# EAGLE design untitled (EAGLE 9.6.2)
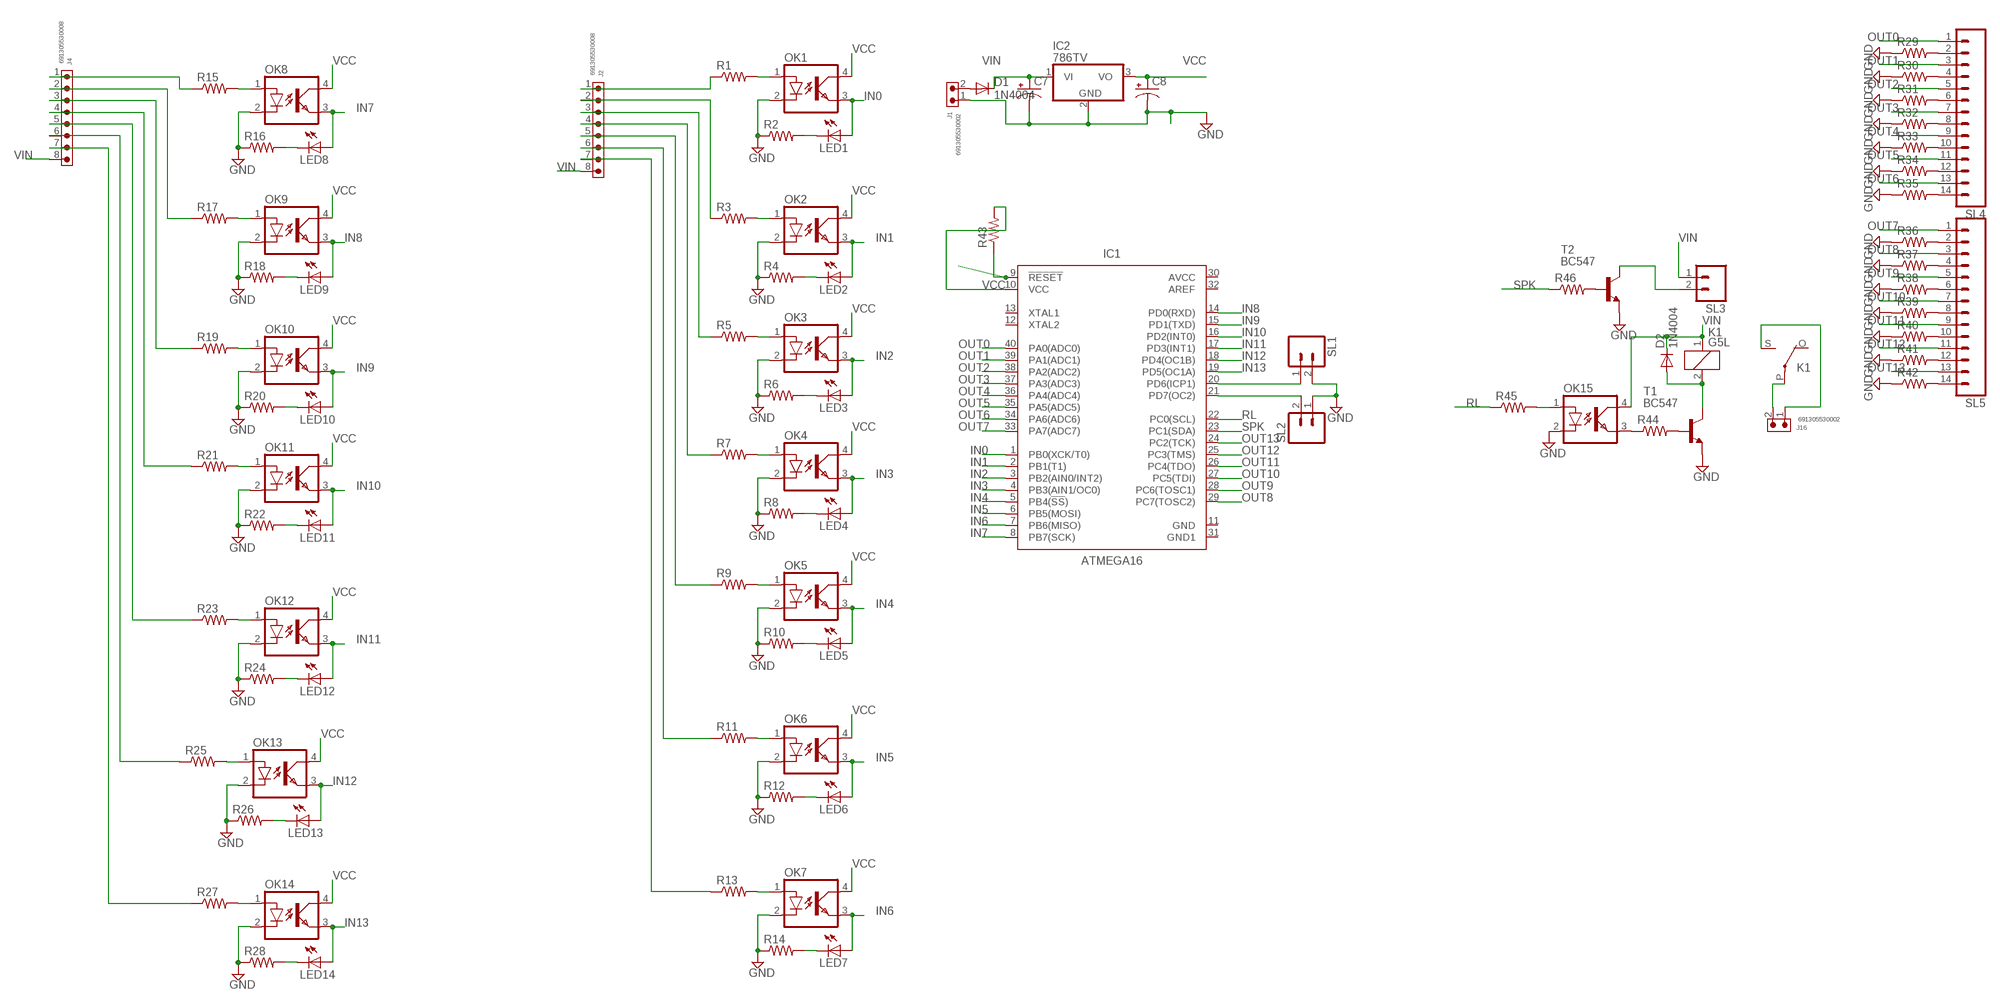
[diagram p0: schematic, sheet 1]

## Parts
C7  CAPACITOR-PE5-10.5  [E5-10,5]
C8  CAPACITOR-PE5-6  [E5-6]
D1  1N4004  [DO41-10]
D2  1N4004  [DO41-10]
IC1  ATMEGA16  ATMEGA32-16PU_DIP  [DIP1587W56P254L5229H482Q40B]
IC2  786TV  [TO220V]
J1  691305530002  691305530002  [691305530002]
J2  691305530008  691305530008  [691305530008]
J4  691305530008  691305530008  [691305530008]
J16  691305530002  691305530002  [691305530002]
K1  G5L  [G5LE]
LED1  LED3MM  [LED3MM]
LED2  LED3MM  [LED3MM]
LED3  LED3MM  [LED3MM]
LED4  LED3MM  [LED3MM]
LED5  LED3MM  [LED3MM]
LED6  LED3MM  [LED3MM]
LED7  LED3MM  [LED3MM]
LED8  LED3MM  [LED3MM]
LED9  LED3MM  [LED3MM]
LED10  LED3MM  [LED3MM]
LED11  LED3MM  [LED3MM]
LED12  LED3MM  [LED3MM]
LED13  LED3MM  [LED3MM]
LED14  LED3MM  [LED3MM]
OK1  PC817  [DIL04]
OK2  PC817  [DIL04]
OK3  PC817  [DIL04]
OK4  PC817  [DIL04]
OK5  PC817  [DIL04]
OK6  PC817  [DIL04]
OK7  PC817  [DIL04]
OK8  PC817  [DIL04]
OK9  PC817  [DIL04]
OK10  PC817  [DIL04]
OK11  PC817  [DIL04]
OK12  PC817  [DIL04]
OK13  PC817  [DIL04]
OK14  PC817  [DIL04]
OK15  PC817  [DIL04]
R1  R-US_0204/2V  [0204V]
R2  R-US_0207/7  [0207/7]
R3  R-US_0204/2V  [0204V]
R4  R-US_0207/7  [0207/7]
R5  R-US_0204/2V  [0204V]
R6  R-US_0207/7  [0207/7]
R7  R-US_0204/2V  [0204V]
R8  R-US_0207/7  [0207/7]
R9  R-US_0204/2V  [0204V]
R10  R-US_0207/7  [0207/7]
R11  R-US_0204/2V  [0204V]
R12  R-US_0207/7  [0207/7]
R13  R-US_0204/2V  [0204V]
R14  R-US_0207/7  [0207/7]
R15  R-US_0204/2V  [0204V]
R16  R-US_0207/7  [0207/7]
R17  R-US_0204/2V  [0204V]
R18  R-US_0207/7  [0207/7]
R19  R-US_0204/2V  [0204V]
R20  R-US_0207/7  [0207/7]
R21  R-US_0204/2V  [0204V]
R22  R-US_0207/7  [0207/7]
R23  R-US_0204/2V  [0204V]
R24  R-US_0207/7  [0207/7]
R25  R-US_0204/2V  [0204V]
R26  R-US_0207/7  [0207/7]
R27  R-US_0204/2V  [0204V]
R28  R-US_0207/7  [0207/7]
R29  R-US_0207/7  [0207/7]
R30  R-US_0207/7  [0207/7]
R31  R-US_0207/7  [0207/7]
R32  R-US_0207/7  [0207/7]
R33  R-US_0207/7  [0207/7]
R34  R-US_0207/7  [0207/7]
R35  R-US_0207/7  [0207/7]
R36  R-US_0207/7  [0207/7]
R37  R-US_0207/7  [0207/7]
R38  R-US_0207/7  [0207/7]
R39  R-US_0207/7  [0207/7]
R40  R-US_0207/7  [0207/7]
R41  R-US_0207/7  [0207/7]
R42  R-US_0207/7  [0207/7]
R43  R-US_0207/7  [0207/7]
R44  R-US_0207/7  [0207/7]
R45  R-US_0204/2V  [0204V]
R46  R-US_0207/7  [0207/7]
SL1  M02  [02P]
SL2  M02  [02P]
SL3  M02  [02P]
SL4  M14  [14P]
SL5  M14  [14P]
T1  BC547  [TO92]
T2  BC547  [TO92]

## Nets
GND: C7.- C8.- IC2.2(GND) J1.1 OK1.2(C) OK2.2(C) OK3.2(C) OK4.2(C) OK5.2(C) OK6.2(C) OK7.2(C) OK8.2(C) OK9.2(C) OK10.2(C) OK11.2(C) OK12.2(C) OK13.2(C) OK14.2(C) OK15.2(C) R2.1 R4.1 R6.1 R8.1 R10.1 R12.1 R14.1 R16.1 R18.1 R20.1 R22.1 R24.1 R26.1 R28.1 R29.1 R30.1 R31.1 R32.1 R33.1 R34.1 R35.1 R36.1 R37.1 R38.1 R39.1 R40.1 R41.1 R42.1 SL1.2 SL2.1 T1.1(E) T2.1(E)
IN0: IC1.1(PB0(XCK/T0)) LED1.A OK1.3(EMIT)
IN1: IC1.2(PB1(T1)) LED2.A OK2.3(EMIT)
IN2: IC1.3(PB2(AIN0/INT2)) LED3.A OK3.3(EMIT)
IN3: IC1.4(PB3(AIN1/OC0)) LED4.A OK4.3(EMIT)
IN4: IC1.5(PB4(!SS!)) LED5.A OK5.3(EMIT)
IN5: IC1.6(PB5(MOSI)) LED6.A OK6.3(EMIT)
IN6: IC1.7(PB6(MISO)) LED7.A OK7.3(EMIT)
IN7: IC1.8(PB7(SCK)) LED8.A OK8.3(EMIT)
IN8: IC1.14(PD0(RXD)) LED9.A OK9.3(EMIT)
IN9: IC1.15(PD1(TXD)) LED10.A OK10.3(EMIT)
IN10: IC1.16(PD2(INT0)) LED11.A OK11.3(EMIT)
IN11: IC1.17(PD3(INT1)) LED12.A OK12.3(EMIT)
IN12: IC1.18(PD4(OC1B)) LED13.A OK13.3(EMIT)
IN13: IC1.19(PD5(OC1A)) LED14.A OK14.3(EMIT)
N$1: J2.1 R1.1
N$2: J2.2 R3.1
N$3: OK1.1(A) R1.2
N$4: J2.3 R5.1
N$5: IC1.9(!RESET!) R43.1
N$6: LED1.K(C) R2.2
N$7: J2.4 R7.1
N$8: OK2.1(A) R3.2
N$9: J2.5 R9.1
N$10: R29.2 SL4.2
N$11: LED2.K(C) R4.2
N$12: J2.6 R11.1
N$13: OK3.1(A) R5.2
N$14: R30.2 SL4.4
N$15: R31.2 SL4.6
N$16: LED3.K(C) R6.2
N$17: J4.2 R17.1
N$18: OK4.1(A) R7.2
N$19: R32.2 SL4.8
N$20: R33.2 SL4.10
N$21: LED4.K(C) R8.2
N$22: J4.4 R21.1
N$23: OK5.1(A) R9.2
N$24: R34.2 SL4.12
N$25: R35.2 SL4.14
N$26: LED5.K(C) R10.2
N$27: J4.6 R25.1
N$28: OK6.1(A) R11.2
N$29: R36.2 SL5.2
N$30: R37.2 SL5.4
N$31: LED6.K(C) R12.2
N$32: J2.7 R13.1
N$33: OK7.1(A) R13.2
N$34: R38.2 SL5.6
N$35: R39.2 SL5.8
N$36: LED7.K(C) R14.2
N$37: J4.1 R15.1
N$38: OK8.1(A) R15.2
N$39: R40.2 SL5.10
N$40: R41.2 SL5.12
N$41: LED8.K(C) R16.2
N$42: R42.2 SL5.14
N$43: OK9.1(A) R17.2
N$44: D2.A K1.2 T1.3(C)
N$45: R44.2 T1.2(B)
N$46: LED9.K(C) R18.2
N$47: J4.3 R19.1
N$48: OK10.1(A) R19.2
N$49: OK15.3(EMIT) R44.1
N$50: OK15.1(A) R45.2
N$51: LED10.K(C) R20.2
N$52: D1.A J1.2
N$53: OK11.1(A) R21.2
N$54: SL3.2 T2.3(C)
N$55: R46.2 T2.2(B)
N$56: LED11.K(C) R22.2
N$57: J4.5 R23.1
N$58: OK12.1(A) R23.2
N$61: LED12.K(C) R24.2
N$63: OK13.1(A) R25.2
N$66: LED13.K(C) R26.2
N$67: J4.7 R27.1
N$68: OK14.1(A) R27.2
N$71: LED14.K(C) R28.2
N$73: IC1.20(PD6(ICP1)) SL1.1
N$74: IC1.21(PD7(OC2)) SL2.2
N$75: J16.2 K1.P(2:P)
N$76: J16.1 K1.S(2:S)
OUT0: IC1.40(PA0(ADC0)) SL4.1
OUT1: IC1.39(PA1(ADC1)) SL4.3
OUT2: IC1.38(PA2(ADC2)) SL4.5
OUT3: IC1.37(PA3(ADC3)) SL4.7
OUT4: IC1.36(PA4(ADC4)) SL4.9
OUT5: IC1.35(PA5(ADC5)) SL4.11
OUT6: IC1.34(PA6(ADC6)) SL4.13
OUT7: IC1.33(PA7(ADC7)) SL5.1
OUT8: IC1.29(PC7(TOSC2)) SL5.3
OUT9: IC1.28(PC6(TOSC1)) SL5.5
OUT10: IC1.27(PC5(TDI)) SL5.7
OUT11: IC1.26(PC4(TDO)) SL5.9
OUT12: IC1.25(PC3(TMS)) SL5.11
OUT13: IC1.24(PC2(TCK)) SL5.13
RL: IC1.22(PC0(SCL)) R45.1
SPK: IC1.23(PC1(SDA)) R46.1
VCC: C8.+ IC1.10(VCC) IC2.3(VO) OK1.4(COL) OK2.4(COL) OK3.4(COL) OK4.4(COL) OK5.4(COL) OK6.4(COL) OK7.4(COL) OK8.4(COL) OK9.4(COL) OK10.4(COL) OK11.4(COL) OK12.4(COL) OK13.4(COL) OK14.4(COL) R43.2
VIN: C7.+ D1.C D2.C IC2.1(VI) J2.8 J4.8 K1.1 OK15.4(COL) SL3.1
Unconnected: IC1.12(XTAL2) IC1.13(XTAL1) IC1.32(AREF) K1.O(2:O)

## Power pins joined to a net without a drawn wire
AVCC: IC1.30(AVCC)
GND: IC1.11(GND)
GND1: IC1.31(GND1)

## Library data of the parts
C7 C8 = BeagleBone_Blue_R3:CAPACITOR-P: POLARIZED CAPACITOR, American symbol
D1 D2 = adafruit:1N4004: DIODE General purpose 1N400x type rectifier (With bigger pads) http://www.ladyada.net/library/pcb/eaglelibrary.html
IC1 = IC_Embedded:ATMEGA32*DIP: 8-bit Microcontroller with 32KBytes In-System Programmable Flash Datasheet <http://ww1.microchip.com/downloads/en/DeviceDoc/doc2503.pdf>; CATEGORY: IC_Embedded; DESCRIPTION: IC MCU 8BIT 32KB FLASH 40DIP; MANUFACTURER: Microchip Technology; MPN: ATMEGA32-16PU; OPERATING_TEMP: -40°C to 85°C; PART_STATUS: Active; SERIES: AVR® ATmega; SPEED: 16MHz; SUB-CATEGORY: Microcontroller
IC2 = linear:78*: Positive VOLTAGE REGULATOR Source: http://cache.national.com/ds/LM/LM78L05.pdf http://www.fairchildsemi.com/ds/LM/LM7805.pdf
J1 J16 = Wurth_Connectors_WR-TBL Pluggable Connector:691305530002: WR-TBL Serie 3055 - 5,08 mm - PCB Header Vertical Entry with Plastic Latches KIND PROPERTIES Pitch 5.08 mm MATERIAL PROPERTIES Insulator Material PA66 Insulator Flammability Rating UL94 V-0 Insulator Color Green Terminal Material Copper Alloy Terminal Plating Tin-plated surface GENERAL INFORMATION Operating Temperature -40 up to +105 °C ELECTRICAL PROPERTIES IR UL 16 A Working Voltage [UL] 300 V (AC) Withstanding Voltage [UL] 2500 V (AC) Contact Resistance [UL] 20 mΩ CERTIFICATION UL Approval E315414 <https://www.we-online.com/catalog/media/o135349v209%20Family_WR-TBL3_6913055300xx.jpg> Details see: https://www.we-online.com/catalog/en/TBL_5_08_3055_6913055300XX/ Updated by Ella Wu 2019-12-30 2019(C) Wurth Elektronik; DATASHEET-URL: https://www.we-online.com/catalog/datasheet/691305530002.pdf; IR-UL: 16A; MOUNT: THT; PART-NUMBER: 691305530002; PINS: 2; PITCH: 5.08mm; TYPE: Vertical; WORKING-VOLTAGE-UL: 300V (AC)
J2 J4 = Wurth_Connectors_WR-TBL Pluggable Connector:691305530008: WR-TBL Serie 3055 - 5,08 mm - PCB Header Vertical Entry with Plastic Latches KIND PROPERTIES Pitch 5.08 mm MATERIAL PROPERTIES Insulator Material PA66 Insulator Flammability Rating UL94 V-0 Insulator Color Green Terminal Material Copper Alloy Terminal Plating Tin-plated surface GENERAL INFORMATION Operating Temperature -40 up to +105 °C ELECTRICAL PROPERTIES IR UL 16 A Working Voltage [UL] 300 V (AC) Withstanding Voltage [UL] 2500 V (AC) Contact Resistance [UL] 20 mΩ CERTIFICATION UL Approval E315414 <https://www.we-online.com/catalog/media/o135349v209%20Family_WR-TBL3_6913055300xx.jpg> Details see: https://www.we-online.com/catalog/en/TBL_5_08_3055_6913055300XX/ Updated by Ella Wu 2019-12-30 2019(C) Wurth Elektronik; DATASHEET-URL: https://www.we-online.com/catalog/datasheet/691305530008.pdf; IR-UL: 16A; MOUNT: THT; PART-NUMBER: 691305530008; PINS: 8; PITCH: 5.08mm; TYPE: Vertical; WORKING-VOLTAGE-UL: 300V (AC)
K1 = relay:G5L: RELAY 1 x switch, 10 A/120 V AC, 8 A/30 V ADC, Omron; OC_FARNELL: unknown; OC_NEWARK: unknown
LED1-LED14 = adafruit:LED: LED OSRAM: - CHIPLED LG R971, LG N971, LY N971, LG Q971, LY Q971, LO R971, LY R971 LH N974, LH R974 LS Q976, LO Q976, LY Q976 LO Q996 - Hyper CHIPLED LW Q18S LB Q993, LB Q99A, LB R99A - SideLED LS A670, LO A670, LY A670, LG A670, LP A670 LB A673, LV A673, LT A673, LW A673 LH A674 LY A675 LS A676, LA A676, LO A676, LY A676, LW A676 LS A679, LY A679, LG A679 - Hyper Micro SIDELED® LS Y876, LA Y876, LO Y876, LY Y876 LT Y87S - SmartLED LW L88C, LW L88S LB L89C, LB L89S, LG L890 LS L89K, LO L89K, LY L89K LS L896, LA L896, LO L896, LY L896 - TOPLED LS T670, LO T670, LY T670, LG T670, LP T670 LSG T670, LSP T670, LSY T670, LOP T670, LYG T670 LG T671, LOG T671, LSG T671 LB T673, LV T673, LT T673, LW T673 LH T674 LS T676, LA T676, LO T676, LY T676, LB T676, LH T676, LSB T676, LW T676 LB T67C, LV T67C, LT T67C, LS T67K, LO T67K, LY T67K, LW E67C LS E67B, LA E67B, LO E67B, LY E67B, LB E67C, LV E67C, LT E67C LW T67C LS T679, LY T679, LG T679 LS T770, LO T770, LY T770, LG T770, LP T770 LB T773, LV T773, LT T773, LW T773 LH T774 LS E675, LA E675, LY E675, LS T675 LS T776, LA T776, LO T776, LY T776, LB T776 LHGB T686 LT T68C, LB T68C - Hyper Mini TOPLED® LB M676 - Mini TOPLED Santana® LG M470 LS M47K, LO M47K, LY M47K Source: http://www.osram.convergy.de/
OK1-OK15 = optocoupler:PC817: SHARP OPTO COUPLER; MPN: PC817X4J000F; OC_FARNELL: 9707727; OC_NEWARK: 97K7059
R1 R3 R5 R7 R9 R11 R13 R15 R17 R19 R21 R23 R25 R27 = BeagleBone_Black_Wireless:R-US_: RESISTOR, American symbol
R2 R4 R6 R8 R10 R12 R14 R16 R18 R20 R22 R24 R26 R28-R46 = adafruit:R-US_: RESISTOR, American symbol
SL1-SL3 = con-amp-quick:M02: AMP QUICK CONNECTOR; OC_FARNELL: unknown; OC_NEWARK: unknown
SL4 SL5 = con-amp-quick:M14: AMP QUICK CONNECTOR; OC_FARNELL: unknown; OC_NEWARK: unknown
T1 T2 = transistor:BC547: NPN TRANSISTOR

## Board
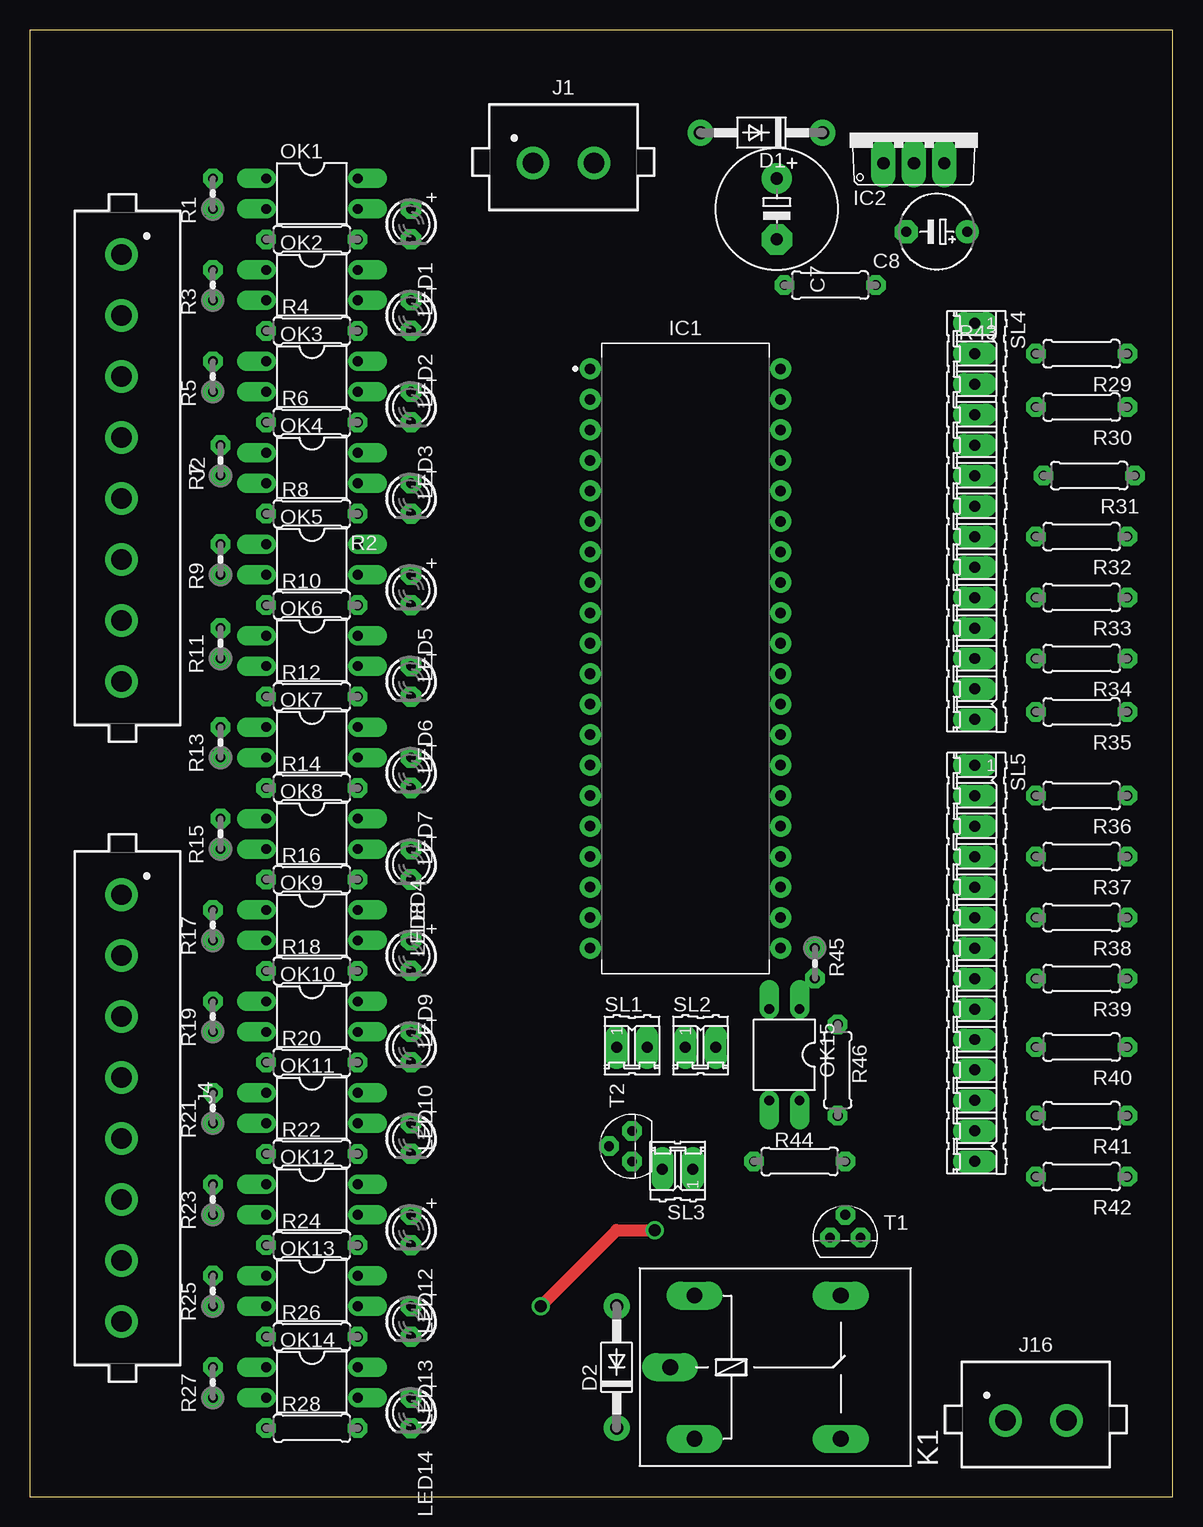
[diagram p1: board, top side]
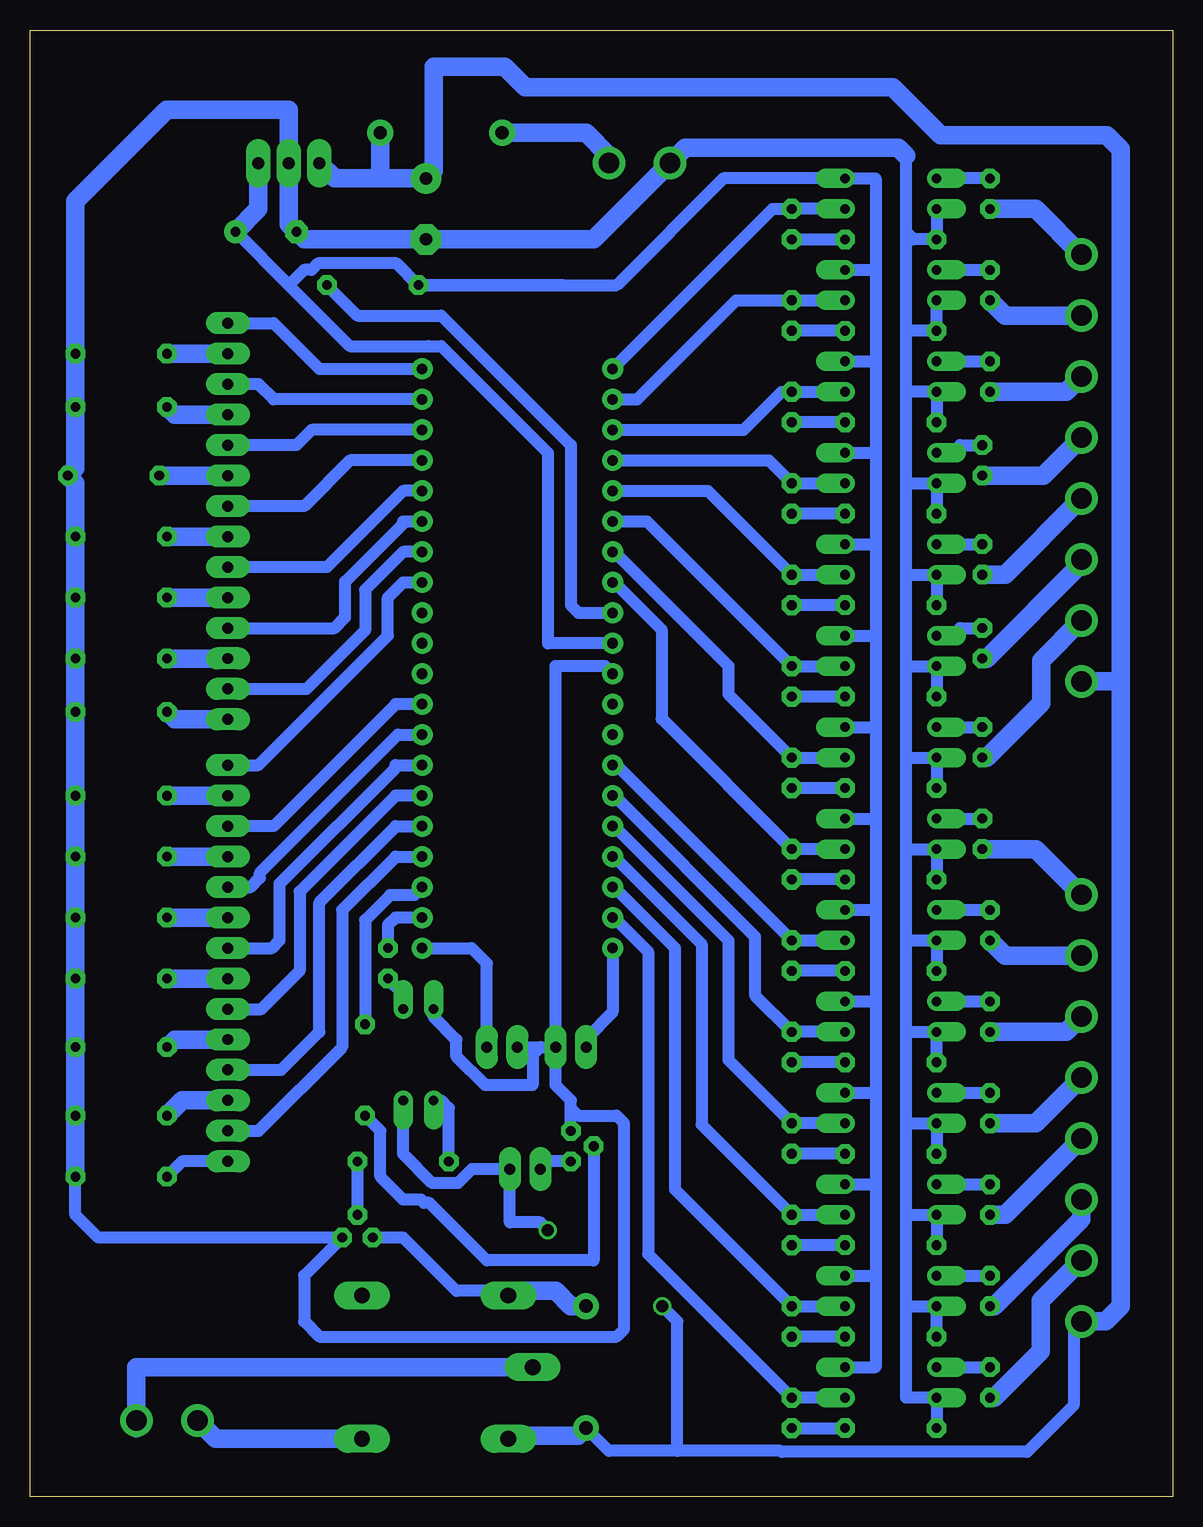
[diagram p2: board, bottom side, seen from below]

Size 95.23 x 122.22 mm. Coordinates in mm from the lower left corner, seen from the top.
Outline: 0,0 95.23,0 95.23,122.22 0,122.22 0,0
Copper layers (1*16): Top 0.035mm / dielectric 1.5mm / Bottom 0.035mm
Design rules "default *": minimum track width 40mil, minimum drill 0.35mm, track to track 25mil, track to pad 25mil, pad to pad 25mil, via to via 25mil, smd to smd 6mil, copper to edge 40mil, drill to drill 6mil, minimum pad ring 10mil, minimum via ring 8mil, stop-mask expansion 4mil, vias tented up to drill 0mil, thermal gap 10mil

### Footprints (pad centres in the part's own frame; a part is rotated, then mirrored left to right if it is on the bottom)
E5-10,5 = drill 1.016 pad 2.54: + -2.54,0 | drill 1.016 pad 2.54 octagon: - 2.54,0
E5-6 = drill 0.813 pad 1.905: + -2.54,0 | drill 0.813 pad 1.905 octagon: - 2.54,0
DO41-10 = drill 1.118 pad 1.93: A 5.08,0; C -5.08,0
DIP1587W56P254L5229H482Q40B = drill 0.877 pad 1.477: 1 -7.938,24.13; 2 -7.938,21.59; 3 -7.938,19.05; 4 -7.938,16.51; 5 -7.938,13.97; 6 -7.938,11.43; 7 -7.938,8.89; 8 -7.938,6.35; 9 -7.938,3.81; 10 -7.938,1.27; 11 -7.938,-1.27; 12 -7.938,-3.81; 13 -7.938,-6.35; 14 -7.938,-8.89; 15 -7.938,-11.43; 16 -7.938,-13.97; 17 -7.938,-16.51; 18 -7.938,-19.05; 19 -7.938,-21.59; 20 -7.938,-24.13; 21 7.938,-24.13; 22 7.938,-21.59; 23 7.938,-19.05; 24 7.938,-16.51; 25 7.938,-13.97; 26 7.938,-11.43; 27 7.938,-8.89; 28 7.938,-6.35; 29 7.938,-3.81; 30 7.938,-1.27; 31 7.938,1.27; 32 7.938,3.81; 33 7.938,6.35; 34 7.938,8.89; 35 7.938,11.43; 36 7.938,13.97; 37 7.938,16.51; 38 7.938,19.05; 39 7.938,21.59; 40 7.938,24.13
TO220V = drill 1.016 long: 1 -2.54,-2.54; 2 0,-2.54; 3 2.54,-2.54
691305530002 = drill 1.7: 1 -2.54,0; 2 2.54,0
691305530008 = drill 1.7: 1 -17.78,0; 2 -12.7,0; 3 -7.62,0; 4 -2.54,0; 5 2.54,0; 6 7.62,0; 7 12.7,0; 8 17.78,0
G5LE = drill 1.321 long: 1 -7.493,-5.969; 2 -7.493,5.969; O 4.699,5.969; P -9.525,0; S 4.699,-5.969
LED3MM = drill 0.813 pad 1.676 octagon: A -1.27,0; K 1.27,0
DIL04 = drill 0.813 offset: 1 -1.27,-3.81; 2 1.27,-3.81; 3 1.27,3.81; 4 -1.27,3.81
0204V = drill 0.813 octagon: 1 -1.27,0; 2 1.27,0
0207/7 = drill 0.813 octagon: 1 -3.81,0; 2 3.81,0
02P = drill 0.914 long: 1 -1.27,0; 2 1.27,0
14P = drill 0.914 long: 1 -16.51,0; 2 -13.97,0; 3 -11.43,0; 4 -8.89,0; 5 -6.35,0; 6 -3.81,0; 7 -1.27,0; 8 1.27,0; 9 3.81,0; 10 6.35,0; 11 8.89,0; 12 11.43,0; 13 13.97,0; 14 16.51,0
TO92 = drill 0.813 octagon: 1 1.27,0; 2 0,1.905; 3 -1.27,0

### Placement (x,y rotation side)
C7  62.23,107.31 270 top
C8  75.56,105.41 180 top
D1  60.96,113.66 180 top
D2  48.89,10.79 90 top
IC1  54.61,69.85 0 top
IC2  73.66,113.66 0 top
J1  44.45,111.12 0 top
J2  7.62,85.72 270 top
J4  7.62,32.38 270 top
J16  83.82,6.35 0 top
K1  62.87,10.79 0 top
LED1  31.75,106.05 270 top
LED2  31.75,98.42 270 top
LED3  31.75,90.8 270 top
LED4  31.75,83.18 270 top
LED5  31.75,75.56 270 top
LED6  31.75,67.94 270 top
LED7  31.75,60.33 270 top
LED8  31.75,52.71 270 top
LED9  31.75,45.09 270 top
LED10  31.75,37.47 270 top
LED11  31.75,29.84 270 top
LED12  31.75,22.23 270 top
LED13  31.75,14.61 270 top
LED14  31.75,6.98 270 top
OK1  23.5,108.58 270 top
OK2  23.5,100.96 270 top
OK3  23.5,93.34 270 top
OK4  23.5,85.72 270 top
OK5  23.5,78.11 270 top
OK6  23.5,70.48 270 top
OK7  23.5,62.87 270 top
OK8  23.5,55.25 270 top
OK9  23.5,47.62 270 top
OK10  23.5,40.01 270 top
OK11  23.5,32.38 270 top
OK12  23.5,24.77 270 top
OK13  23.5,17.14 270 top
OK14  23.5,9.53 270 top
OK15  62.87,36.83 180 top
R1  15.24,108.58 90 top
R2  23.5,104.77 0 top
R3  15.24,100.96 90 top
R4  23.5,97.16 0 top
R5  15.24,93.34 90 top
R6  23.5,89.53 0 top
R7  15.88,86.36 90 top
R8  23.5,81.91 0 top
R9  15.88,78.11 90 top
R10  23.5,74.3 0 top
R11  15.88,71.12 90 top
R12  23.5,66.67 0 top
R13  15.88,62.87 90 top
R14  23.5,59.05 0 top
R15  15.88,55.25 90 top
R16  23.5,51.44 0 top
R17  15.24,47.62 90 top
R18  23.5,43.81 0 top
R19  15.24,40.01 90 top
R20  23.5,36.2 0 top
R21  15.24,32.38 90 top
R22  23.5,28.58 0 top
R23  15.24,24.77 90 top
R24  23.5,20.95 0 top
R25  15.24,17.14 90 top
R26  23.5,13.34 0 top
R27  15.24,9.53 90 top
R28  23.5,5.71 0 top
R29  87.63,95.25 180 top
R30  87.63,90.8 180 top
R31  88.27,85.09 180 top
R32  87.63,80.01 180 top
R33  87.63,74.93 180 top
R34  87.63,69.85 180 top
R35  87.63,65.41 180 top
R36  87.63,58.42 180 top
R37  87.63,53.34 180 top
R38  87.63,48.26 180 top
R39  87.63,43.18 180 top
R40  87.63,37.47 180 top
R41  87.63,31.75 180 top
R42  87.63,26.67 180 top
R43  66.67,100.96 180 top
R44  64.14,27.94 0 top
R45  65.41,44.45 270 top
R46  67.31,35.56 270 top
SL1  50.16,37.47 0 top
SL2  55.88,37.47 0 top
SL3  53.98,27.3 180 top
SL4  78.74,81.28 270 top
SL5  78.74,44.45 270 top
T1  67.95,21.59 0 top
T2  50.16,29.21 90 top

### Tracks (layer width: path | path; a pad name or v marks a point on that pad's centre or on a via)
GND
  Bottom 1.016: OK1.2 R2.1 21.59,104.77 22.23,105.41 | 22.23,105.41 22.23,111.76 | 22.23,15.88 22.23,8.25 OK14.2 R28.1 | 22.23,15.88 22.23,23.5 | 22.23,23.5 22.23,31.12 | 22.23,31.12 22.23,38.73 | 22.23,38.73 22.23,46.35 | 22.23,46.35 22.23,53.98 | 22.23,53.98 22.23,61.59 | 22.23,61.59 22.23,69.22 | 22.23,69.22 22.23,76.83 | 22.23,76.83 22.23,84.45 | 22.23,84.45 22.23,92.07 | 22.23,92.07 22.23,97.16 | 22.23,97.16 22.23,105.41 | OK2.2 R4.1 22.23,97.16 | 22.23,92.07 OK3.2 R6.1 | 22.23,84.45 OK4.2 R8.1 | 22.23,76.83 OK5.2 R10.1 | 22.23,69.22 OK6.2 R12.1 | 22.23,61.59 OK7.2 R14.1 | 22.23,53.98 OK8.2 R16.1 | 22.23,46.35 OK9.2 R18.1 | 22.23,38.73 OK10.2 R20.1 | 22.23,31.12 OK11.2 R22.1 | 22.23,23.5 OK12.2 R24.1 | 22.23,15.88 OK13.2 R26.1 | IC1.11 47.31,69.22 51.44,69.22 SL1.2 | SL2.1 52.7,37.47 | 52.7,37.47 SL1.2 | 52.7,37.47 53.34,36.83 53.34,34.29 57.31,34.29 59.69,36.67 59.69,38.1 61.59,40.01 OK15.2 61.59,41.91 | R42.1 91.44,23.5 89.53,21.59 T1.1 72.39,18.41 72.39,14.61 71.12,13.34 46.35,13.34 45.72,13.97 45.72,31.12 46.35,31.75 49.53,31.75 50.16,32.38 | T2.1 50.16,32.38 | 50.16,32.38 50.16,33.02 51.44,34.29 SL1.2 | R29.1 91.44,95.88
  Bottom 1.524: 22.23,111.76 22.86,112.39 40.64,112.39 J1.1 48.26,104.77 54.61,104.77 56.52,104.77 C7.- 72.39,104.77 C8.- 73.66,106.05 IC2.2 73.66,115.57 83.82,115.57 91.44,107.95 91.44,95.88 | R42.1 R41.1 R40.1 R39.1 R38.1 R37.1 R36.1 R35.1 R34.1 R33.1 R32.1 91.44,84.45 R31.1 91.44,85.72 R30.1 R29.1
IN0
  Bottom 1.016: OK1.3 LED1.A 33.34,107.31 IC1.1
IN1
  Bottom 1.016: OK2.3 28.63,99.69 LED2.A 36.39,99.69 44.64,91.44 IC1.2
IN2
  Bottom 1.016: LED3.A 28.63,92.07 OK3.3 | 32.59,92.07 LED3.A | IC1.3 35.76,88.9 32.59,92.07 | 32.59,92.07 LED3.A
IN3
  Bottom 1.016: OK4.3 28.63,84.45 LED4.A 33.66,86.36 IC1.4
IN4
  Bottom 1.016: OK5.3 28.63,76.83 LED5.A 38.73,83.82 IC1.5
IN5
  Bottom 1.016: OK6.3 28.63,69.22 LED6.A 43.81,81.28 IC1.6
IN6
  Bottom 1.016: OK7.3 28.63,61.59 LED7.A 37.04,66.89 37.04,69.23 46.55,78.74 IC1.7
IN7
  Bottom 1.016: IC1.8 46.55,76.2 42.6,72.25 42.6,64.82 LED8.A OK8.3
IN8
  Bottom 1.016: IC1.14 46.35,60.96 LED9.A OK9.3
IN9
  Bottom 1.016: IC1.15 46.55,58.42 34.81,46.68 34.81,41.8 LED10.A OK10.3
IN10
  Bottom 1.016: IC1.16 46.55,55.88 37.04,46.37 37.04,36.41 LED11.A OK11.3
IN11
  Bottom 1.016: IC1.17 46.55,53.34 39.27,46.05 39.27,31.01 LED12.A OK12.3
IN12
  Bottom 1.016: IC1.18 46.55,50.8 41.49,45.74 41.49,25.62 LED13.A OK13.3
IN13
  Bottom 1.016: OK14.3 LED14.A 43.71,20.22 43.71,45.42 46.55,48.26 IC1.19
N$1
  Bottom 1.524: R1.1 11.43,107.31 J2.1
N$2
  Bottom 1.524: R3.1 13.97,98.42 J2.2
N$3
  Bottom 1.016: R1.2 OK1.1
N$4
  Bottom 1.524: R5.1 8.89,92.07 J2.3
N$5
  Bottom 1.016: R43.1 67.95,98.42 60.96,98.42 50.16,87.63 50.16,74.3 49.53,73.66 IC1.9
N$6
  Bottom 1.016: LED1.K R2.2
N$7
  Bottom 1.524: R7.1 10.79,85.09 J2.4
N$8
  Bottom 1.016: OK2.1 18.36,102.23 R3.2
N$9
  Bottom 1.524: R9.1 13.97,76.83 J2.5
N$10
  Bottom 1.524: R29.2 79.45,95.25 SL4.2
N$11
  Bottom 1.016: R4.2 LED2.K
N$12
  Bottom 1.524: R11.1 15.5,69.85 7.62,77.73 J2.6
N$13
  Bottom 1.016: OK3.1 18.36,94.61 R5.2
N$14
  Bottom 1.524: R30.2 83.19,90.17 79.45,90.17 SL4.4
N$15
  Bottom 1.524: R31.2 79.45,85.09 SL4.6
N$16
  Bottom 1.016: R6.2 LED3.K
N$17
  Bottom 1.524: R17.1 13.97,45.09 J4.2
N$18
  Bottom 1.016: OK4.1 18.36,86.99 17.73,87.63 R7.2
N$19
  Bottom 1.524: R32.2 79.45,80.01 SL4.8
N$20
  Bottom 1.524: R33.2 79.45,74.93 SL4.10
N$21
  Bottom 1.016: R8.2 LED4.K
N$22
  Bottom 1.524: R21.1 11.43,31.12 J4.4
N$23
  Bottom 1.016: OK5.1 18.36,79.38 R9.2
N$24
  Bottom 1.524: R34.2 79.45,69.85 SL4.12
N$25
  Bottom 1.524: R35.2 83.19,64.77 79.45,64.77 SL4.14
N$26
  Bottom 1.016: R10.2 LED5.K
N$27
  Bottom 1.524: R25.1 14.87,15.88 7.62,23.12 J4.6
N$28
  Bottom 1.016: OK6.1 18.36,71.75 17.73,72.39 R11.2
N$29
  Bottom 1.524: R36.2 79.45,58.42 SL5.2
N$30
  Bottom 1.524: R37.2 79.45,53.34 SL5.4
N$31
  Bottom 1.016: R12.2 LED6.K
N$32
  Bottom 1.524: R13.1 15.5,61.59 10.97,66.13 10.97,69.68 J2.7
N$33
  Bottom 1.016: OK7.1 18.36,64.14 R13.2
N$34
  Bottom 1.524: R38.2 79.45,48.26 SL5.6
N$35
  Bottom 1.524: R39.2 79.45,43.18 SL5.8
N$36
  Bottom 1.016: R14.2 LED7.K
N$37
  Bottom 1.524: R15.1 11.43,53.98 J4.1
N$38
  Bottom 1.016: OK8.1 18.36,56.52 R15.2
N$39
  Bottom 1.524: R40.2 83.19,38.1 79.45,38.1 SL5.10
N$40
  Bottom 1.524: R41.2 82.55,33.02 79.45,33.02 SL5.12
N$41
  Bottom 1.016: R16.2 LED8.K
N$42
  Bottom 1.016: SL5.14 82.55,27.94 R42.2
N$43
  Bottom 1.016: OK9.1 R17.2
N$44
  Bottom 1.016: K1.2 55.75,17.14 59.69,17.14 64.14,21.59 T1.3
  Bottom 1.524: D2.A 50.16,15.88 51.44,17.14 54.99,17.14 K1.2
N$45
  Bottom 1.016: R44.2 T1.2
N$46
  Bottom 1.016: R18.2 LED9.K
N$47
  Bottom 1.524: R19.1 8.89,38.73 J4.3
N$48
  Bottom 1.016: OK10.1 R19.2
N$49
  Bottom 1.016: R44.1 60.33,32.38 60.96,33.02 OK15.3 61.59,31.75
N$50
  Bottom 1.016: R45.2 64.14,41.91 OK15.1 64.14,41.27
N$51
  Bottom 1.016: R20.2 LED10.K
N$52
  Bottom 1.524: D1.A 48.89,113.66 46.99,111.76 J1.2
N$53
  Bottom 1.016: OK11.1 R21.2
N$54
  Bottom 1.016: T2.3 52.07,27.94 SL3.2
N$55
  Bottom 1.016: T2.2 48.26,19.69 57.15,19.69 61.95,24.49 62.38,24.49 62.66,24.77 64.14,24.77 66.04,26.67 66.04,30.48 R46.2
N$56
  Bottom 1.016: R22.2 LED11.K
N$57
  Bottom 1.524: R23.1 13.97,23.5 J4.5
N$58
  Bottom 1.016: OK12.1 R23.2
N$61
  Bottom 1.016: R24.2 LED12.K
N$63
  Bottom 1.016: OK13.1 R25.2
N$66
  Bottom 1.016: R26.2 LED13.K
N$67
  Bottom 1.524: R27.1 14.87,8.25 10.98,12.14 10.98,16.32 J4.7
N$68
  Bottom 1.016: OK14.1 R27.2
N$71
  Bottom 1.016: LED14.K R28.2
N$73
  Bottom 1.016: IC1.20 46.67,40.4 48.89,38.18 SL1.1
N$74
  Bottom 1.016: SL2.2 57.15,44.45 58.42,45.72 IC1.21
N$75
  Bottom 1.016: J16.2 86.36,5.71
  Bottom 1.524: K1.P 86.36,10.79 86.36,5.71
N$76
  Bottom 1.524: J16.1 79.76,4.83 K1.S
OUT0
  Bottom 1.016: SL4.1 74.93,97.79 71.12,93.98 IC1.40
OUT1
  Bottom 1.016: IC1.39 74.93,91.44 76.2,92.71 SL4.3
OUT2
  Bottom 1.016: IC1.38 71.75,88.9 73.03,87.63 SL4.5
OUT3
  Bottom 1.016: IC1.37 68.58,86.36 72.39,82.55 SL4.7
OUT4
  Bottom 1.016: IC1.36 64.14,83.82 70.48,77.47 SL4.9
OUT5
  Bottom 1.016: SL4.11 69.85,72.39 68.96,73.28 68.96,76.25 64.14,81.07 64.14,81.28 IC1.35
OUT6
  Bottom 1.016: IC1.34 64.14,78.74 67.31,75.56 67.31,72.19 72.19,67.31 SL4.13 79.38,67.31
OUT7
  Bottom 1.016: SL5.1 76.2,60.96 65.41,71.75 65.41,74.93 64.14,76.2 IC1.33
OUT8
  Bottom 1.016: IC1.29 64.77,66.04 74.93,55.88 SL5.3
OUT9
  Bottom 1.016: SL5.5 76.83,50.8 76.07,51.56 76.07,51.99 64.56,63.5 IC1.28
OUT10
  Bottom 1.016: SL5.7 75.06,45.72 74.42,46.35 74.42,51.1 64.77,60.76 64.77,60.96 IC1.27
OUT11
  Bottom 1.016: IC1.26 64.77,58.42 72.77,50.42 72.77,43.81 75.95,40.64 SL5.9 79.38,40.64
OUT12
  Bottom 1.016: SL5.11 74.3,35.56 71.12,38.73 71.12,49.53 64.77,55.88 IC1.25
OUT13
  Bottom 1.016: SL5.13 76.2,30.48 69.22,37.47 69.22,48.9 64.77,53.34 IC1.24
RL
  Bottom 1.016: IC1.22 64.77,48.26 65.41,47.62 R45.1
SPK
  Bottom 1.016: R46.1 67.31,48.05 65.22,50.14 63.21,50.14 IC1.23
VCC
  Bottom 1.016: 24.77,102.23 24.77,109.85 OK1.4 37.47,109.85 46.35,100.96 51.44,100.96 R43.2 | 24.77,102.23 24.77,94.61 | 24.77,94.61 24.77,86.99 | 24.77,86.99 24.77,79.38 | 24.77,79.38 24.77,71.75 | 24.77,71.75 24.77,64.14 | 24.77,64.14 24.77,56.52 | 24.77,56.52 24.77,48.9 | 24.77,48.9 24.77,41.27 | 24.77,41.27 24.77,33.66 | 24.77,33.66 24.77,26.04 | 24.77,26.04 24.77,18.41 | 24.77,18.41 24.77,10.79 OK14.4 27.94,10.79 | OK2.4 24.77,102.23 | OK3.4 24.77,94.61 | OK6.4 24.77,71.75 | OK9.4 24.77,48.9 | OK10.4 24.77,41.27 | OK11.4 24.77,33.66 | OK12.4 24.77,26.04 | OK13.4 24.77,18.41 | IC1.10 52.07,71.12 52.07,86.99 60.96,95.88 62.02,95.88 | R43.2 64.67,102.77 71.23,102.77 71.77,102.23 72.39,102.23 73.66,100.96 | 62.02,95.88 68.58,95.88 73.66,100.96 | 62,95.86 62.02,95.88 | C8.+ 73.66,100.96 | OK5.4 24.77,79.38 | OK4.4 24.77,86.99 | OK7.4 24.77,64.14 | OK8.4 24.77,56.52 | 50.8,100.96 R43.2
  Bottom 1.524: IC2.3 76.2,107.31 C8.+
VIN  (via drill 1)
  Top 1.016: v42.55,15.88 48.89,22.23 v52.07,22.23
  Bottom 1.016: OK15.4 64.14,28.58 61.7,26.14 59.58,26.14 58.41,27.3 SL3.1 55.24,22.86 52.7,22.86 v52.07,22.23 | J4.8 8.26,13.97 8.26,7.62 12.14,3.73 32.57,3.73 32.65,3.81 41.27,3.81 | D2.C 46.99,3.81 41.27,3.81 | 41.27,3.81 41.27,14.61 v42.55,15.88
  Bottom 1.524: J4.8 5.59,14.61 4.32,15.88 4.32,67.82 | 4.32,67.82 4.45,67.94 J2.8 | 4.32,67.82 4.32,112.27 5.51,113.46 19.33,113.46 23.34,117.47 53.98,117.47 55.68,119.18 61.59,119.18 61.59,110.49 C7.+ 66.04,109.85 | 66.04,109.85 69.85,109.85 IC2.1 | D2.C 49.53,5.08 55.88,5.08 55.63,4.83 K1.1 | D1.C 66.04,109.85